# Altium schematic sheet KA2_4.SchDoc
size 420 x 297 mm; SheetNumber: 4; SheetTotal: 6
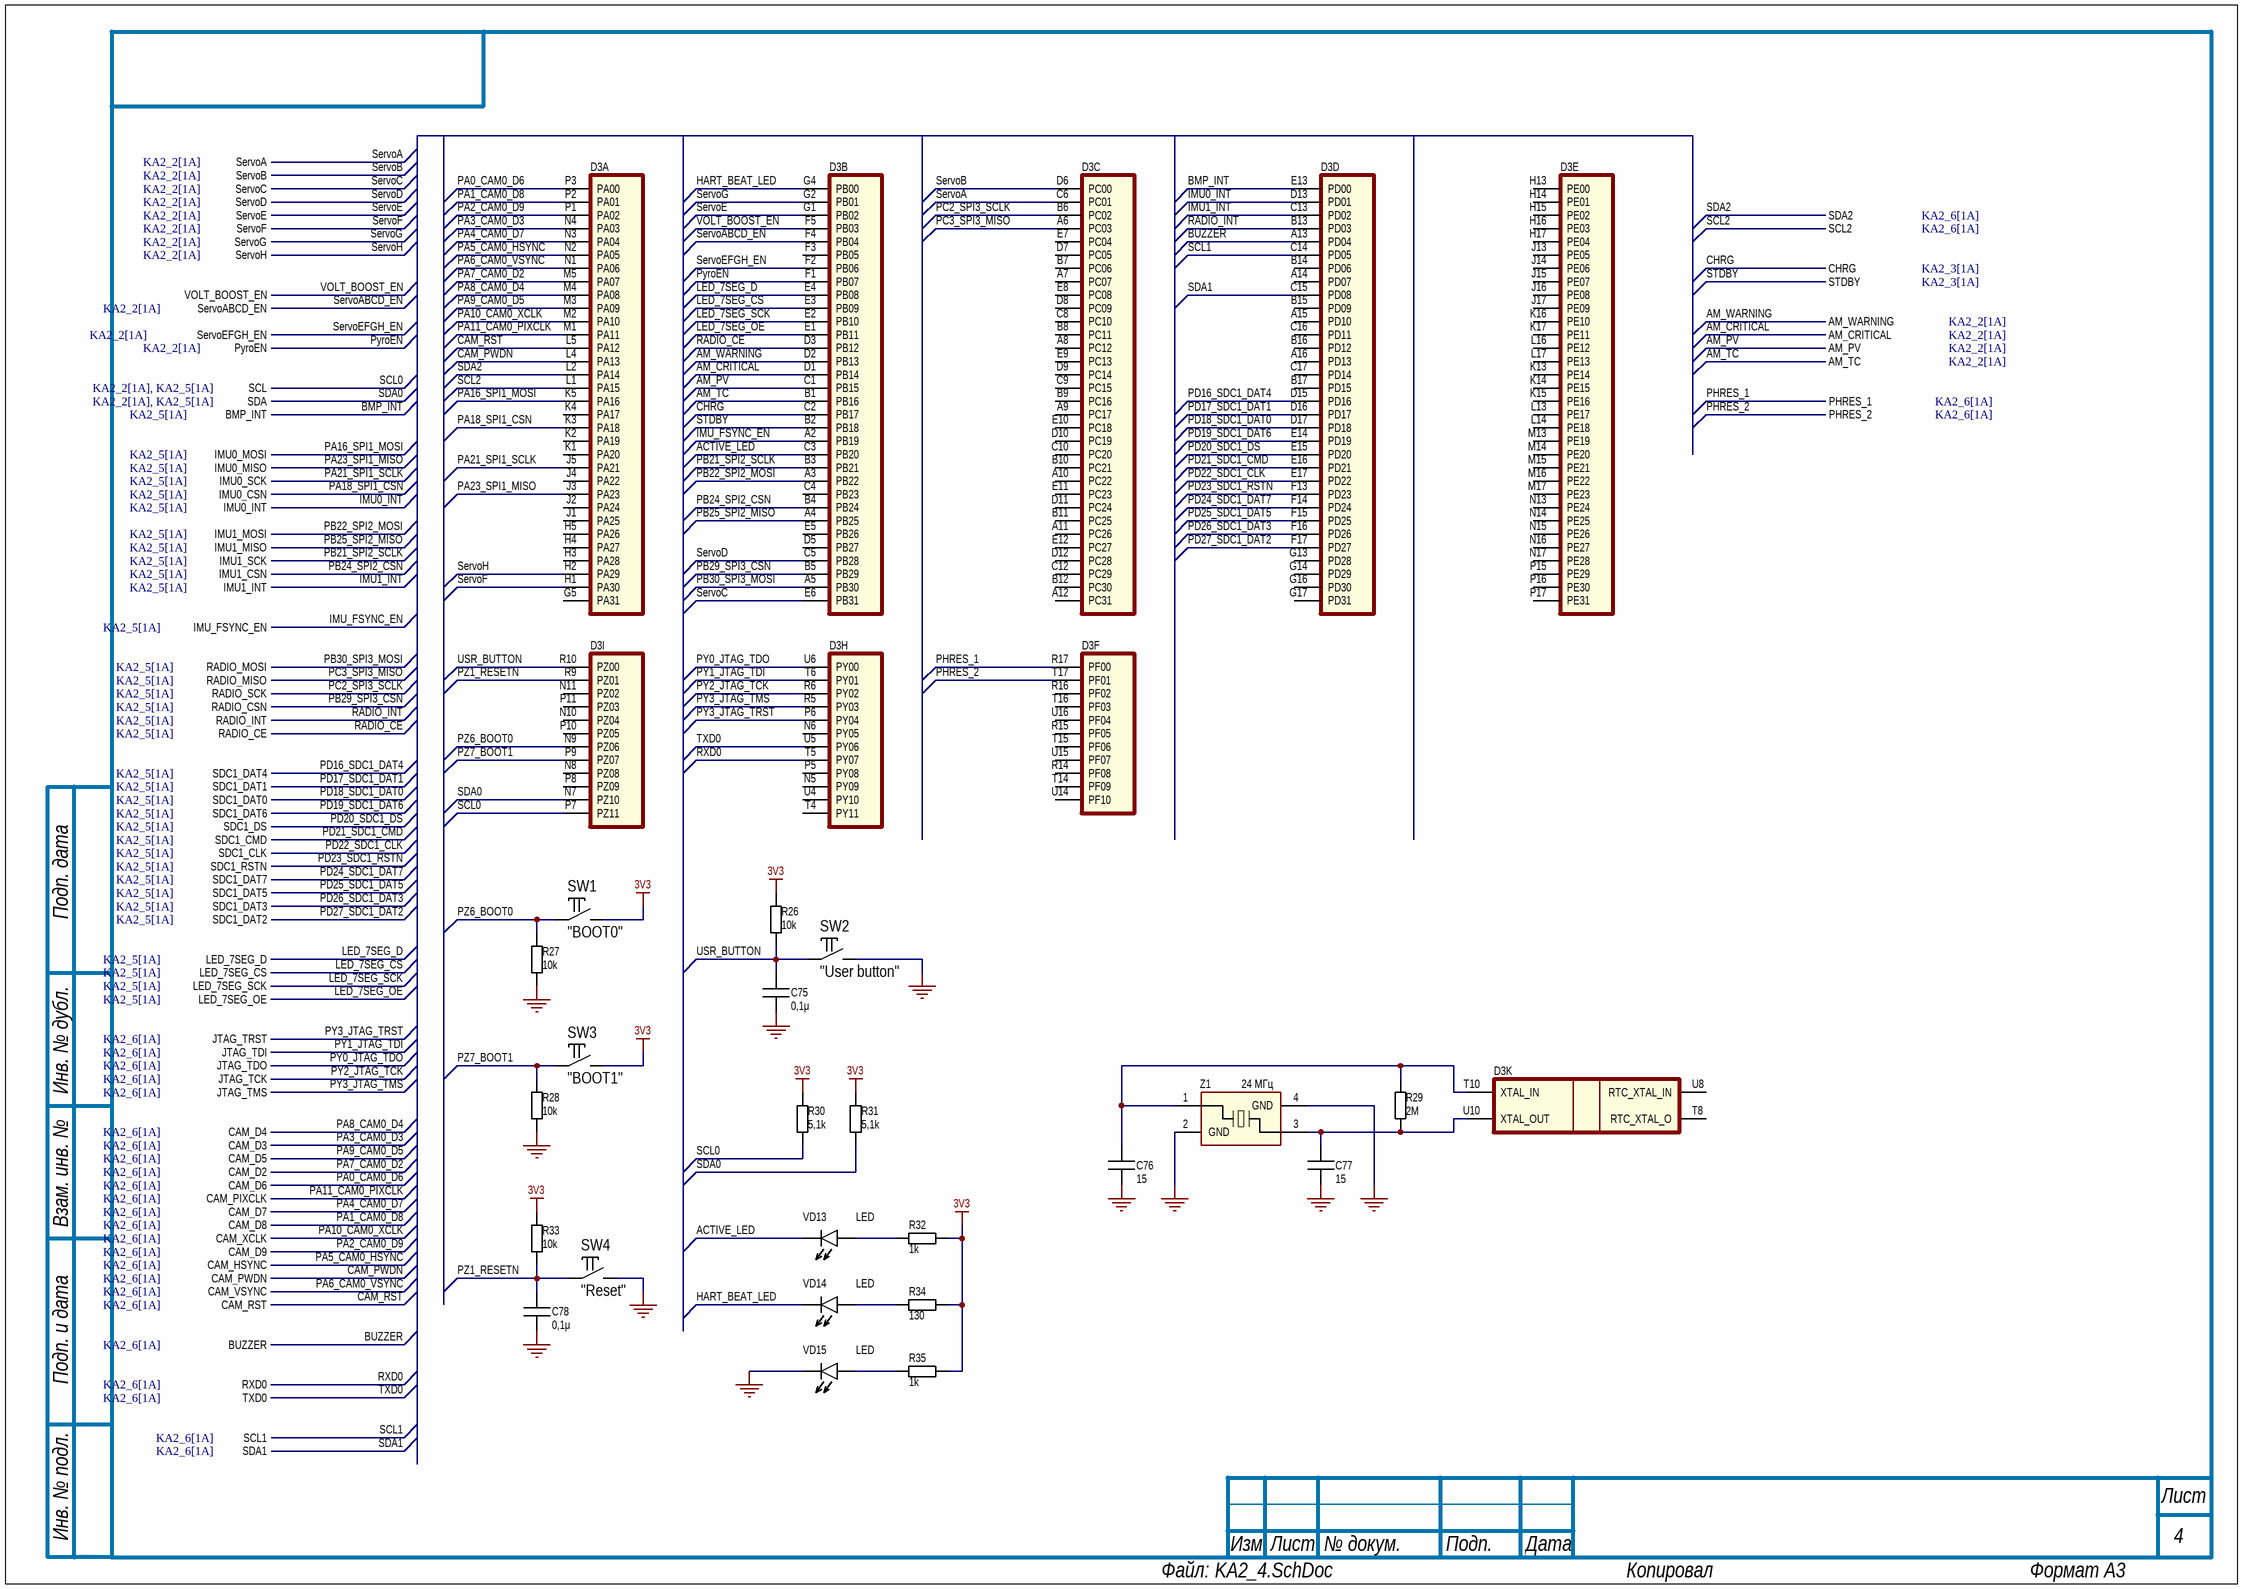
[diagram p0: KA2_4.SchDoc]

## Parts
C75  value 0,1μ  [Capacitor_0402]
C76  value 15  [Capacitor_0402]
C77  value 15  [Capacitor_0402]
C78  value 0,1μ  [Capacitor_0402]
D3  HPM6754IVM2  [HPM6754IVM2_BGA-289_14x14mm]  (value not drawn)  (parts A,B,C,D,E,F,H,I,K of 11)
R26  value 10k  [RES: 0402]
R27  value 10k  [RES: 0402]
R28  value 10k  [RES: 0402]
R29  value 2M  [RES: 0402]
R30  value 5,1k  [RES: 0402]
R31  value 5,1k  [RES: 0402]
R32  value 1k  [RES: 0402]
R33  value 10k  [RES: 0402]
R34  value 130  [RES: 0402]
R35  value 1k  [RES: 0402]
SW1  CommentText: "BOOT0"  [Button_4.2x2.3mm]  (hidden comment: Tactile Switch SPST 400gf 2.5mm 4.2mm x 3.2mm Surface Mount)
SW2  CommentText: "User button"  [Button_4.2x2.3mm]  (hidden comment: Tactile Switch SPST 400gf 2.5mm 4.2mm x 3.2mm Surface Mount)
SW3  CommentText: "BOOT1"  [Button_4.2x2.3mm]  (hidden comment: Tactile Switch SPST 400gf 2.5mm 4.2mm x 3.2mm Surface Mount)
SW4  CommentText: "Reset"  [Button_4.2x2.3mm]  (hidden comment: Tactile Switch SPST 400gf 2.5mm 4.2mm x 3.2mm Surface Mount)
VD13  value LED  [LED: 0603Y]  (hidden comment: LED_0603_Y)
VD14  value LED  [LED: 0603Y]  (hidden comment: 451nm LED Indication - Discrete 2.9V 0603)
VD15  value LED  [LED: 0603Y]  (hidden comment: LED_0603_Y)
Z1  value 24 МГц  [OSC: 2016]  (hidden comment: Crystal_XL7EL89CKI-111YLC-24M)

## Ports
AM_CRITICAL (see KA2_2[1A]), AM_PV (see KA2_2[1A]), AM_TC (see KA2_2[1A]), AM_WARNING (see KA2_2[1A]), BMP_INT (see KA2_5[1A]), BUZZER (see KA2_6[1A]), CAM_D2 (see KA2_6[1A]), CAM_D3 (see KA2_6[1A]), CAM_D4 (see KA2_6[1A]), CAM_D5 (see KA2_6[1A]), CAM_D6 (see KA2_6[1A]), CAM_D7 (see KA2_6[1A]), CAM_D8 (see KA2_6[1A]), CAM_D9 (see KA2_6[1A]), CAM_HSYNC (see KA2_6[1A]), CAM_PIXCLK (see KA2_6[1A]), CAM_PWDN (see KA2_6[1A]), CAM_RST (see KA2_6[1A]), CAM_VSYNC (see KA2_6[1A]), CAM_XCLK (see KA2_6[1A]), CHRG (see KA2_3[1A]), IMU0_CSN (see KA2_5[1A]), IMU0_INT (see KA2_5[1A]), IMU0_MISO (see KA2_5[1A]), IMU0_MOSI (see KA2_5[1A]), IMU0_SCK (see KA2_5[1A]), IMU1_CSN (see KA2_5[1A]), IMU1_INT (see KA2_5[1A]), IMU1_MISO (see KA2_5[1A]), IMU1_MOSI (see KA2_5[1A]), IMU1_SCK (see KA2_5[1A]), IMU_FSYNC_EN (see KA2_5[1A]), JTAG_TCK (see KA2_6[1A]), JTAG_TDI (see KA2_6[1A]), JTAG_TDO (see KA2_6[1A]), JTAG_TMS (see KA2_6[1A]), JTAG_TRST (see KA2_6[1A]), LED_7SEG_CS (see KA2_5[1A]), LED_7SEG_D (see KA2_5[1A]), LED_7SEG_OE (see KA2_5[1A]), LED_7SEG_SCK (see KA2_5[1A]), PHRES_1 (see KA2_6[1A]), PHRES_2 (see KA2_6[1A]), PyroEN (see KA2_2[1A]), RADIO_CE (see KA2_5[1A]), RADIO_CSN (see KA2_5[1A]), RADIO_INT (see KA2_5[1A]), RADIO_MISO (see KA2_5[1A]), RADIO_MOSI (see KA2_5[1A]), RADIO_SCK (see KA2_5[1A]), RXD0 (see KA2_6[1A]), SCL1 (see KA2_6[1A]), SCL2 (see KA2_6[1A]), SCL (see KA2_2[1A], KA2_5[1A]), SDA1 (see KA2_6[1A]), SDA2 (see KA2_6[1A]), SDA (see KA2_2[1A], KA2_5[1A]), SDC1_CLK (see KA2_5[1A]), SDC1_CMD (see KA2_5[1A]), SDC1_DAT0 (see KA2_5[1A]), SDC1_DAT1 (see KA2_5[1A]), SDC1_DAT2 (see KA2_5[1A]), SDC1_DAT3 (see KA2_5[1A]), SDC1_DAT4 (see KA2_5[1A]), SDC1_DAT5 (see KA2_5[1A]), SDC1_DAT6 (see KA2_5[1A]), SDC1_DAT7 (see KA2_5[1A]), SDC1_DS (see KA2_5[1A]), SDC1_RSTN (see KA2_5[1A]), ServoA (see KA2_2[1A]), ServoABCD_EN (see KA2_2[1A]), ServoB (see KA2_2[1A]), ServoC (see KA2_2[1A]), ServoD (see KA2_2[1A]), ServoE (see KA2_2[1A]), ServoEFGH_EN (see KA2_2[1A]), ServoF (see KA2_2[1A]), ServoG (see KA2_2[1A]), ServoH (see KA2_2[1A]), STDBY (see KA2_3[1A]), TXD0 (see KA2_6[1A]), VOLT_BOOST_EN

## Nets
3V3: R26.2 R30.2 R31.2 R32.1 R33.2 R34.1 R35.1 SW1.2 SW3.2
GND: C75.1 C76.1 C77.1 C78.1 R27.1 R28.1 SW2.2 SW4.2 VD15.K(Kathode) Z1.2(GND) Z1.4(GND)
ACTIVE_LED: D3.C3(PB20) VD13.K(Kathode)
AM_CRITICAL: D3.D1(PB14) ; port AM_CRITICAL
AM_PV: D3.C1(PB15) ; port AM_PV
AM_TC: D3.B1(PB16) ; port AM_TC
AM_WARNING: D3.D2(PB13) ; port AM_WARNING
BMP_INT: D3.E13(PD00) ; port BMP_INT
BUZZER: D3.A13(PD04) ; port BUZZER
CAM_PWDN: D3.L4(PA13) ; port CAM_PWDN
CAM_RST: D3.L5(PA12) ; port CAM_RST
CHRG: D3.C2(PB17) ; port CHRG
HART_BEAT_LED: D3.G4(PB00) VD14.K(Kathode)
IMU0_INT: D3.D13(PD01) ; port IMU0_INT
IMU1_INT: D3.C13(PD02) ; port IMU1_INT
IMU_FSYNC_EN: D3.A2(PB19) ; port IMU_FSYNC_EN
LED_7SEG_CS: D3.E3(PB09) ; port LED_7SEG_CS
LED_7SEG_D: D3.E4(PB08) ; port LED_7SEG_D
LED_7SEG_OE: D3.E1(PB11) ; port LED_7SEG_OE
LED_7SEG_SCK: D3.E2(PB10) ; port LED_7SEG_SCK
PA0_CAM0_D6: D3.P3(PA00) ; port CAM_D6
PA1_CAM0_D8: D3.P2(PA01) ; port CAM_D8
PA2_CAM0_D9: D3.P1(PA02) ; port CAM_D9
PA3_CAM0_D3: D3.N4(PA03) ; port CAM_D3
PA4_CAM0_D7: D3.N3(PA04) ; port CAM_D7
PA5_CAM0_HSYNC: D3.N2(PA05) ; port CAM_HSYNC
PA6_CAM0_VSYNC: D3.N1(PA06) ; port CAM_VSYNC
PA7_CAM0_D2: D3.M5(PA07) ; port CAM_D2
PA8_CAM0_D4: D3.M4(PA08) ; port CAM_D4
PA9_CAM0_D5: D3.M3(PA09) ; port CAM_D5
PA10_CAM0_XCLK: D3.M2(PA10) ; port CAM_XCLK
PA11_CAM0_PIXCLK: D3.M1(PA11) ; port CAM_PIXCLK
PA16_SPI1_MOSI: D3.K5(PA16) ; port IMU0_MOSI
PA18_SPI1_CSN: D3.K3(PA18) ; port IMU0_CSN
PA21_SPI1_SCLK: D3.J5(PA21) ; port IMU0_SCK
PA23_SPI1_MISO: D3.J3(PA23) ; port IMU0_MISO
PB21_SPI2_SCLK: D3.B3(PB21) ; port IMU1_SCK
PB22_SPI2_MOSI: D3.A3(PB22) ; port IMU1_MOSI
PB24_SPI2_CSN: D3.B4(PB24) ; port IMU1_CSN
PB25_SPI2_MISO: D3.A4(PB25) ; port IMU1_MISO
PB29_SPI3_CSN: D3.B5(PB29) ; port RADIO_CSN
PB30_SPI3_MOSI: D3.A5(PB30) ; port RADIO_MOSI
PC2_SPI3_SCLK: D3.B6(PC02) ; port RADIO_SCK
PC3_SPI3_MISO: D3.A6(PC03) ; port RADIO_MISO
PD16_SDC1_DAT4: D3.D15(PD16) ; port SDC1_DAT4
PD17_SDC1_DAT1: D3.D16(PD17) ; port SDC1_DAT1
PD18_SDC1_DAT0: D3.D17(PD18) ; port SDC1_DAT0
PD19_SDC1_DAT6: D3.E14(PD19) ; port SDC1_DAT6
PD20_SDC1_DS: D3.E15(PD20) ; port SDC1_DS
PD21_SDC1_CMD: D3.E16(PD21) ; port SDC1_CMD
PD22_SDC1_CLK: D3.E17(PD22) ; port SDC1_CLK
PD23_SDC1_RSTN: D3.F13(PD23) ; port SDC1_RSTN
PD24_SDC1_DAT7: D3.F14(PD24) ; port SDC1_DAT7
PD25_SDC1_DAT5: D3.F15(PD25) ; port SDC1_DAT5
PD26_SDC1_DAT3: D3.F16(PD26) ; port SDC1_DAT3
PD27_SDC1_DAT2: D3.F17(PD27) ; port SDC1_DAT2
PHRES_1: D3.R17(PF00) ; port PHRES_1
PHRES_2: D3.T17(PF01) ; port PHRES_2
PY0_JTAG_TDO: D3.U6(PY00) ; port JTAG_TDO
PY1_JTAG_TDI: D3.T6(PY01) ; port JTAG_TDI
PY2_JTAG_TCK: D3.R6(PY02) ; port JTAG_TCK
PY3_JTAG_TMS: D3.R5(PY03) ; port JTAG_TMS
PY3_JTAG_TRST: D3.P6(PY04) ; port JTAG_TRST
PyroEN: D3.F1(PB07) ; port PyroEN
PZ1_RESETN: C78.2 D3.R9(PZ01) R33.1 SW4.1
PZ6_BOOT0: D3.N9(PZ06) R27.2 SW1.1
PZ7_BOOT1: D3.P9(PZ07) R28.2 SW3.1
RADIO_CE: D3.D3(PB12) ; port RADIO_CE
RADIO_INT: D3.B13(PD03) ; port RADIO_INT
RXD0: D3.T5(PY07) ; port RXD0
SCL0: D3.P7(PZ11) R30.1 ; port SCL
SCL1: D3.C14(PD05) ; port SCL1
SCL2: D3.L1(PA15) ; port SCL2
SDA0: D3.N7(PZ10) R31.1 ; port SDA
SDA1: D3.C15(PD08) ; port SDA1
SDA2: D3.L2(PA14) ; port SDA2
ServoA: D3.C6(PC01) ; port ServoA
ServoABCD_EN: D3.F4(PB04) ; port ServoABCD_EN
ServoB: D3.D6(PC00) ; port ServoB
ServoC: D3.E6(PB31) ; port ServoC
ServoD: D3.C5(PB28) ; port ServoD
ServoE: D3.G1(PB02) ; port ServoE
ServoEFGH_EN: D3.F2(PB06) ; port ServoEFGH_EN
ServoF: D3.H1(PA30) ; port ServoF
ServoG: D3.G2(PB01) ; port ServoG
ServoH: D3.H2(PA29) ; port ServoH
STDBY: D3.B2(PB18) ; port STDBY
TXD0: D3.U5(PY06) ; port TXD0
USR_BUTTON: C75.2 D3.R10(PZ00) R26.1 SW2.1
VOLT_BOOST_EN: D3.F5(PB03) ; port VOLT_BOOST_EN
NetC76_2: C76.2 D3.T10(XTAL_IN) R29.2 Z1.1(X1)
NetC77_2: C77.2 D3.U10(XTAL_OUT) R29.1 Z1.3(X2)
NetR32_2: R32.2 VD13.A(Anode)
NetR34_2: R34.2 VD14.A(Anode)
NetR35_2: R35.2 VD15.A(Anode)

Not connected (* = marked no-connect by the designer): D3 A7(PC07) A8(PC12) A9(PC17) A10(PC22) A11(PC26) A12(PC31) A14(PD07) A15(PD10) A16(PD13) B7(PC06) B8(PC11) B9(PC16) B10(PC21) B11(PC25) B12(PC30) B14(PD06) B15(PD09) B16(PD12) B17(PD15) C4(PB23) C8(PC10) C9(PC15) C10(PC20) C12(PC29) C16(PD11) C17(PD14) D5(PB27) D7(PC05) D8(PC09) D9(PC14) D10(PC19) D11(PC24) D12(PC28) E5(PB26) E7(PC04) E8(PC08) E9(PC13) E10(PC18) E11(PC23) E12(PC27) F3(PB05) G5(PA31) G13(PD28) G14(PD29) G16(PD30) G17(PD31) H3(PA28) H4(PA27) H5(PA26) H13(PE00) H14(PE01) H15(PE02) H16(PE03) H17(PE04) J1(PA25) J2(PA24) J4(PA22) J13(PE05) J14(PE06) J15(PE07) J16(PE08) J17(PE09) K1(PA20) K2(PA19) K4(PA17) K13(PE14) K14(PE15) K15(PE16) K16(PE10) K17(PE11) L13(PE17) L14(PE18) L16(PE12) L17(PE13) M13(PE19) M14(PE20) M15(PE21) M16(PE22) M17(PE23) N5(PY09) N6(PY05) N8(PZ08) N10(PZ04) N11(PZ02) N13(PE24) N14(PE25) N15(PE26) N16(PE27) N17(PE28) P5(PY08) P8(PZ09) P10(PZ05) P11(PZ03) P15(PE29) P16(PE30) P17(PE31) R14(PF08) R15(PF05) R16(PF02) T4(PY11) T8(RTC_XTAL_O) T14(PF09) T15(PF06) T16(PF03) U4(PY10) U8(RTC_XTAL_IN) U14(PF10) U15(PF07) U16(PF04)

## Notes on the sheet
- Подп. дата
- Инв. № дубл.
- Взам. инв. №
- Подп. и дата
- Инв. № подл.
- Изм.
- Лист
- № докум.
- Подп.
- Дата
- ALTIUM GOSTBOM2.0 KEV
- Файл:
- Копировал
- Формат А3

## Library data of the parts
C75 C78 = Ceramic_0402: ValueManufacturerPartNumber: Ceramic capacitor, 0,1μ, X7R, ±10%, 16V, 0402; TypeCapacitor: Ceramic capacitor; Tolerance: ±10%; TypeDielectric: X7R; Voltage: 16V; Manufacturer: *; HelpURL: *; Package: 0402; Mfr.Part: *
C76 C77 = Ceramic_0402: ValueManufacturerPartNumber: Ceramic capacitor, 15, X7R, ±10%, 16V, 0402; TypeCapacitor: Ceramic capacitor; Tolerance: ±10%; TypeDielectric: X7R; Voltage: 16V; Manufacturer: *; HelpURL: *; Package: 0402; Mfr.Part: *
D3 = HPM6754IVM2: Микроконтроллер RISC-V, 2xRV32GCBP@816МГц, 2МБ ОЗУ, BGA-289 14x14mm; Manufacturer: HPMICRO; Mfr.Part: HPM6754IVM2; Value: HPM6754IVM2; HelpURL: https://www.lcsc.com/product-detail/C49451874.html
R26-R28 R33 = Resistor_0402: ValueManufacturerPartNumber: Resistor, 10k, ±1%, 0402; Tolerance: ±1%; Manufacturer: *; Package: 0402; Mfr.Part: *; TypeResistor: Resistor; HelpURL: *
R29 = Resistor_0402: ValueManufacturerPartNumber: Resistor, 2M, ±1%, 0402; Tolerance: ±1%; Manufacturer: *; Package: 0402; Mfr.Part: *; TypeResistor: Resistor; HelpURL: *
R30 R31 = Resistor_0402: ValueManufacturerPartNumber: Resistor, 5,1k, ±1%, 0402; Tolerance: ±1%; Manufacturer: *; Package: 0402; Mfr.Part: *; TypeResistor: Resistor; HelpURL: *
R32 R35 = Resistor_0402: ValueManufacturerPartNumber: Resistor, 1k, ±1%, 0402; Tolerance: ±1%; Manufacturer: *; Package: 0402; Mfr.Part: *; TypeResistor: Resistor; HelpURL: *
R34 = Resistor_0402: ValueManufacturerPartNumber: Resistor, 130, ±1%, 0402; Tolerance: ±1%; Manufacturer: *; Package: 0402; Mfr.Part: *; TypeResistor: Resistor; HelpURL: *
SW1-SW4 = Switch_GT-TC048D-H025-L1: Микропереключатель SMD, SMD-4P,4.2x3.2mm; Manufacturer: G-Switch; HelpURL: https://www.lcsc.com/product-detail/C843674.html; Mfr.Part: GT-TC048D-H025-L1
VD13 VD15 = LED_0603_Y: Светодиод желтый, 0603; Mfr.Part: TJ-S1608CY6T5ALC9Y-A5; Manufacturer: TOGIALED; HelpURL: https://www.lcsc.com/product-detail/C2837010.html
VD14 = LED_0603_W: Светодиод белый, 0603; Mfr.Part: TZ0603W3G-001/2#; Manufacturer: TUOZHAN; HelpURL: https://www.lcsc.com/product-detail/C3011232.html
Z1 = Crystal_XL7EL89CKI-111YLC-24M: Кварцевый резонатор 24 МГц 2016; Manufacturer: YXC Crystal Oscillators; Mfr.Part: XL7EL89CKI-111YLC-24M; HelpURL: https://www.lcsc.com/product-detail/C2965580.html